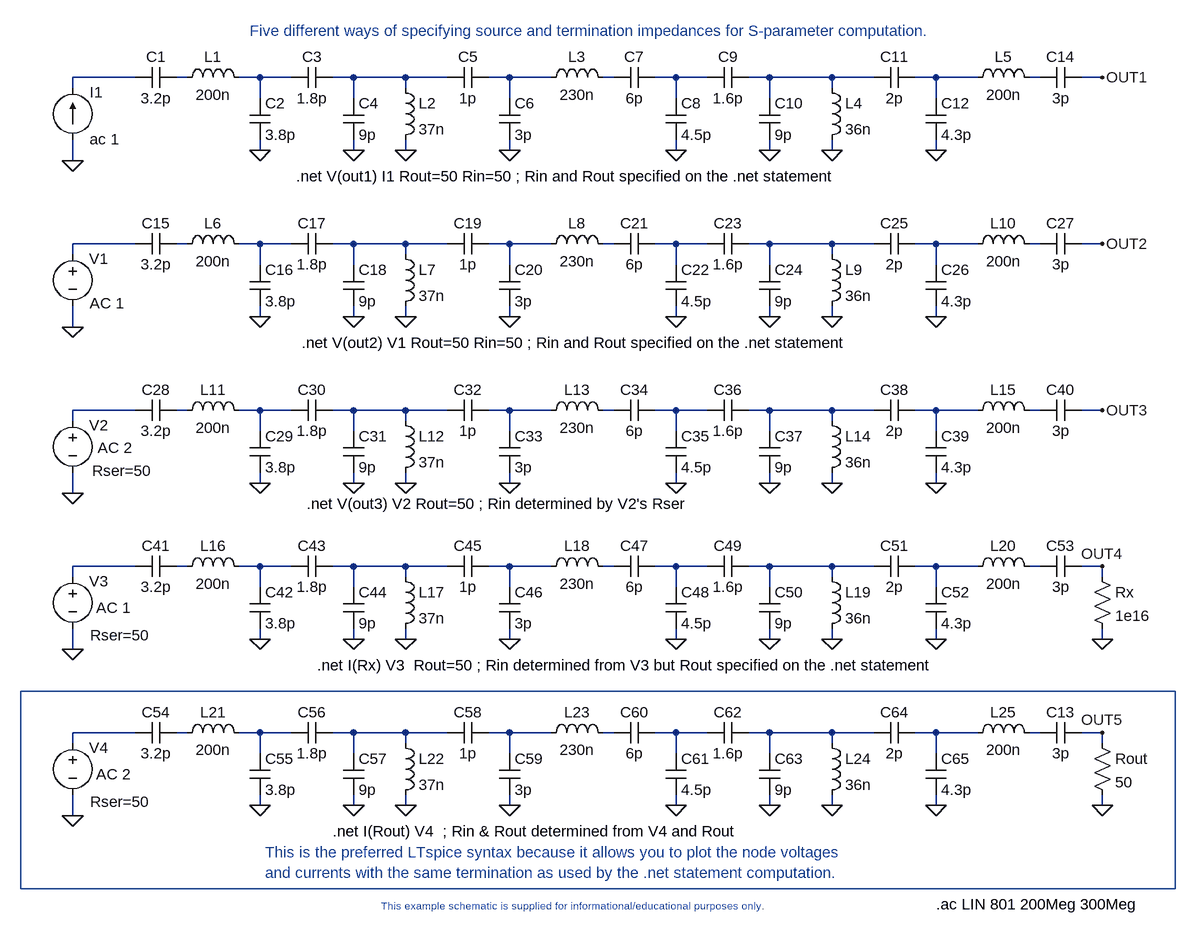
[diagram p0: schematic S-param.asc]
S-param.asc, the LTspice schematic file:
Version 4
SHEET 1 2384 1052
WIRE 128 -608 32 -608
WIRE 208 -608 192 -608
WIRE 320 -608 288 -608
WIRE 368 -608 320 -608
WIRE 464 -608 432 -608
WIRE 544 -608 464 -608
WIRE 608 -608 544 -608
WIRE 704 -608 672 -608
WIRE 768 -608 704 -608
WIRE 864 -608 848 -608
WIRE 960 -608 928 -608
WIRE 1008 -608 960 -608
WIRE 1104 -608 1072 -608
WIRE 1200 -608 1104 -608
WIRE 1264 -608 1200 -608
WIRE 1360 -608 1328 -608
WIRE 1424 -608 1360 -608
WIRE 1520 -608 1504 -608
WIRE 1616 -608 1584 -608
WIRE 32 -592 32 -608
WIRE 544 -592 544 -608
WIRE 1200 -592 1200 -608
WIRE 320 -576 320 -608
WIRE 464 -576 464 -608
WIRE 704 -576 704 -608
WIRE 960 -576 960 -608
WIRE 1104 -576 1104 -608
WIRE 1360 -576 1360 -608
WIRE 320 -496 320 -512
WIRE 464 -496 464 -512
WIRE 544 -496 544 -512
WIRE 704 -496 704 -512
WIRE 960 -496 960 -512
WIRE 1104 -496 1104 -512
WIRE 1200 -496 1200 -512
WIRE 1360 -496 1360 -512
WIRE 32 -480 32 -512
WIRE 128 -352 32 -352
WIRE 208 -352 192 -352
WIRE 320 -352 288 -352
WIRE 368 -352 320 -352
WIRE 464 -352 432 -352
WIRE 544 -352 464 -352
WIRE 608 -352 544 -352
WIRE 704 -352 672 -352
WIRE 768 -352 704 -352
WIRE 864 -352 848 -352
WIRE 960 -352 928 -352
WIRE 1008 -352 960 -352
WIRE 1104 -352 1072 -352
WIRE 1200 -352 1104 -352
WIRE 1264 -352 1200 -352
WIRE 1360 -352 1328 -352
WIRE 1424 -352 1360 -352
WIRE 1520 -352 1504 -352
WIRE 1616 -352 1584 -352
WIRE 32 -336 32 -352
WIRE 544 -336 544 -352
WIRE 1200 -336 1200 -352
WIRE 320 -320 320 -352
WIRE 464 -320 464 -352
WIRE 704 -320 704 -352
WIRE 960 -320 960 -352
WIRE 1104 -320 1104 -352
WIRE 1360 -320 1360 -352
WIRE 320 -240 320 -256
WIRE 464 -240 464 -256
WIRE 544 -240 544 -256
WIRE 704 -240 704 -256
WIRE 960 -240 960 -256
WIRE 1104 -240 1104 -256
WIRE 1200 -240 1200 -256
WIRE 1360 -240 1360 -256
WIRE 32 -224 32 -256
WIRE 128 -96 32 -96
WIRE 208 -96 192 -96
WIRE 320 -96 288 -96
WIRE 368 -96 320 -96
WIRE 464 -96 432 -96
WIRE 544 -96 464 -96
WIRE 608 -96 544 -96
WIRE 704 -96 672 -96
WIRE 768 -96 704 -96
WIRE 864 -96 848 -96
WIRE 960 -96 928 -96
WIRE 1008 -96 960 -96
WIRE 1104 -96 1072 -96
WIRE 1200 -96 1104 -96
WIRE 1264 -96 1200 -96
WIRE 1360 -96 1328 -96
WIRE 1424 -96 1360 -96
WIRE 1520 -96 1504 -96
WIRE 1616 -96 1584 -96
WIRE 32 -80 32 -96
WIRE 544 -80 544 -96
WIRE 1200 -80 1200 -96
WIRE 320 -64 320 -96
WIRE 464 -64 464 -96
WIRE 704 -64 704 -96
WIRE 960 -64 960 -96
WIRE 1104 -64 1104 -96
WIRE 1360 -64 1360 -96
WIRE 320 16 320 0
WIRE 464 16 464 0
WIRE 544 16 544 0
WIRE 704 16 704 0
WIRE 960 16 960 0
WIRE 1104 16 1104 0
WIRE 1200 16 1200 0
WIRE 1360 16 1360 0
WIRE 32 32 32 0
WIRE 128 144 32 144
WIRE 208 144 192 144
WIRE 320 144 288 144
WIRE 368 144 320 144
WIRE 464 144 432 144
WIRE 544 144 464 144
WIRE 608 144 544 144
WIRE 704 144 672 144
WIRE 768 144 704 144
WIRE 864 144 848 144
WIRE 960 144 928 144
WIRE 1008 144 960 144
WIRE 1104 144 1072 144
WIRE 1200 144 1104 144
WIRE 1264 144 1200 144
WIRE 1360 144 1328 144
WIRE 1424 144 1360 144
WIRE 1520 144 1504 144
WIRE 1616 144 1584 144
WIRE 32 160 32 144
WIRE 544 160 544 144
WIRE 1200 160 1200 144
WIRE 1616 160 1616 144
WIRE 320 176 320 144
WIRE 464 176 464 144
WIRE 704 176 704 144
WIRE 960 176 960 144
WIRE 1104 176 1104 144
WIRE 1360 176 1360 144
WIRE 320 256 320 240
WIRE 464 256 464 240
WIRE 544 256 544 240
WIRE 704 256 704 240
WIRE 960 256 960 240
WIRE 1104 256 1104 240
WIRE 1200 256 1200 240
WIRE 1360 256 1360 240
WIRE 1616 256 1616 240
WIRE 32 272 32 240
WIRE 128 400 32 400
WIRE 208 400 192 400
WIRE 320 400 288 400
WIRE 368 400 320 400
WIRE 464 400 432 400
WIRE 544 400 464 400
WIRE 608 400 544 400
WIRE 704 400 672 400
WIRE 768 400 704 400
WIRE 864 400 848 400
WIRE 960 400 928 400
WIRE 1008 400 960 400
WIRE 1104 400 1072 400
WIRE 1200 400 1104 400
WIRE 1264 400 1200 400
WIRE 1360 400 1328 400
WIRE 1424 400 1360 400
WIRE 1520 400 1504 400
WIRE 1616 400 1584 400
WIRE 32 416 32 400
WIRE 544 416 544 400
WIRE 1200 416 1200 400
WIRE 1616 416 1616 400
WIRE 320 432 320 400
WIRE 464 432 464 400
WIRE 704 432 704 400
WIRE 960 432 960 400
WIRE 1104 432 1104 400
WIRE 1360 432 1360 400
WIRE 320 512 320 496
WIRE 464 512 464 496
WIRE 544 512 544 496
WIRE 704 512 704 496
WIRE 960 512 960 496
WIRE 1104 512 1104 496
WIRE 1200 512 1200 496
WIRE 1360 512 1360 496
WIRE 1616 512 1616 496
WIRE 32 528 32 496
FLAG 32 528 0
FLAG 1616 512 0
FLAG 32 32 0
FLAG 1616 -96 OUT3
FLAG 32 -224 0
FLAG 1616 -352 OUT2
FLAG 32 -480 0
FLAG 1616 -608 OUT1
FLAG 32 272 0
FLAG 1616 256 0
FLAG 1616 144 OUT4
FLAG 1616 400 OUT5
FLAG 320 -496 0
FLAG 464 -496 0
FLAG 544 -496 0
FLAG 704 -496 0
FLAG 960 -496 0
FLAG 1104 -496 0
FLAG 1200 -496 0
FLAG 1360 -496 0
FLAG 320 -240 0
FLAG 464 -240 0
FLAG 544 -240 0
FLAG 704 -240 0
FLAG 960 -240 0
FLAG 1104 -240 0
FLAG 1200 -240 0
FLAG 1360 -240 0
FLAG 320 16 0
FLAG 464 16 0
FLAG 544 16 0
FLAG 704 16 0
FLAG 960 16 0
FLAG 1104 16 0
FLAG 1200 16 0
FLAG 1360 16 0
FLAG 320 256 0
FLAG 464 256 0
FLAG 544 256 0
FLAG 704 256 0
FLAG 960 256 0
FLAG 1104 256 0
FLAG 1200 256 0
FLAG 1360 256 0
FLAG 320 512 0
FLAG 464 512 0
FLAG 544 512 0
FLAG 704 512 0
FLAG 960 512 0
FLAG 1104 512 0
FLAG 1200 512 0
FLAG 1360 512 0
SYMBOL res 1600 400 R0
SYMATTR InstName Rout
SYMATTR Value 50
SYMBOL voltage 32 400 R0
WINDOW 0 25 23 Left 2
WINDOW 3 25 93 Left 2
WINDOW 123 36 64 Left 2
WINDOW 39 27 106 Left 2
SYMATTR InstName V4
SYMATTR Value ""
SYMATTR Value2 AC 2
SYMATTR SpiceLine Rser=50
SYMBOL voltage 32 -96 R0
WINDOW 0 25 23 Left 2
WINDOW 3 25 93 Left 2
WINDOW 123 38 58 Left 2
WINDOW 39 30 93 Left 2
SYMATTR InstName V2
SYMATTR Value ""
SYMATTR Value2 AC 2
SYMATTR SpiceLine Rser=50
SYMBOL voltage 32 -352 R0
WINDOW 0 25 23 Left 2
WINDOW 3 25 93 Left 2
WINDOW 123 26 91 Left 2
SYMATTR InstName V1
SYMATTR Value ""
SYMATTR Value2 AC 1
SYMBOL current 32 -512 M180
WINDOW 0 26 73 Left 2
WINDOW 3 26 1 Left 2
SYMATTR InstName I1
SYMATTR Value ac 1
SYMBOL res 1600 144 R0
SYMATTR InstName Rx
SYMATTR Value 1e16
SYMBOL voltage 32 144 R0
WINDOW 0 25 23 Left 2
WINDOW 3 25 93 Left 2
WINDOW 123 36 64 Left 2
WINDOW 39 27 106 Left 2
SYMATTR InstName V3
SYMATTR Value ""
SYMATTR Value2 AC 1
SYMATTR SpiceLine Rser=50
SYMBOL cap 128 -624 M90
WINDOW 0 0 32 VBottom 2
WINDOW 3 32 32 VTop 2
SYMATTR InstName C1
SYMATTR Value 3.2p
SYMBOL ind 192 -592 R270
WINDOW 0 32 56 VTop 2
WINDOW 3 5 56 VBottom 2
SYMATTR InstName L1
SYMATTR Value 200n
SYMBOL cap 304 -576 R0
SYMATTR InstName C2
SYMATTR Value 3.8p
SYMBOL cap 368 -624 M90
WINDOW 0 0 32 VBottom 2
WINDOW 3 32 32 VTop 2
SYMATTR InstName C3
SYMATTR Value 1.8p
SYMBOL cap 448 -576 R0
SYMATTR InstName C4
SYMATTR Value 9p
SYMBOL ind 528 -608 R0
SYMATTR InstName L2
SYMATTR Value 37n
SYMBOL cap 608 -624 M90
WINDOW 0 0 32 VBottom 2
WINDOW 3 32 32 VTop 2
SYMATTR InstName C5
SYMATTR Value 1p
SYMBOL cap 688 -576 R0
SYMATTR InstName C6
SYMATTR Value 3p
SYMBOL ind 752 -592 R270
WINDOW 0 32 56 VTop 2
WINDOW 3 5 56 VBottom 2
SYMATTR InstName L3
SYMATTR Value 230n
SYMBOL cap 864 -624 M90
WINDOW 0 0 32 VBottom 2
WINDOW 3 32 32 VTop 2
SYMATTR InstName C7
SYMATTR Value 6p
SYMBOL cap 944 -576 R0
SYMATTR InstName C8
SYMATTR Value 4.5p
SYMBOL cap 1008 -624 M90
WINDOW 0 0 32 VBottom 2
WINDOW 3 32 32 VTop 2
SYMATTR InstName C9
SYMATTR Value 1.6p
SYMBOL cap 1088 -576 R0
SYMATTR InstName C10
SYMATTR Value 9p
SYMBOL ind 1184 -608 R0
SYMATTR InstName L4
SYMATTR Value 36n
SYMBOL cap 1264 -624 M90
WINDOW 0 0 32 VBottom 2
WINDOW 3 32 32 VTop 2
SYMATTR InstName C11
SYMATTR Value 2p
SYMBOL cap 1344 -576 R0
SYMATTR InstName C12
SYMATTR Value 4.3p
SYMBOL ind 1408 -592 R270
WINDOW 0 32 56 VTop 2
WINDOW 3 5 56 VBottom 2
SYMATTR InstName L5
SYMATTR Value 200n
SYMBOL cap 1520 -624 M90
WINDOW 0 0 32 VBottom 2
WINDOW 3 32 32 VTop 2
SYMATTR InstName C14
SYMATTR Value 3p
SYMBOL cap 128 -368 M90
WINDOW 0 0 32 VBottom 2
WINDOW 3 32 32 VTop 2
SYMATTR InstName C15
SYMATTR Value 3.2p
SYMBOL ind 192 -336 R270
WINDOW 0 32 56 VTop 2
WINDOW 3 5 56 VBottom 2
SYMATTR InstName L6
SYMATTR Value 200n
SYMBOL cap 304 -320 R0
SYMATTR InstName C16
SYMATTR Value 3.8p
SYMBOL cap 368 -368 M90
WINDOW 0 0 32 VBottom 2
WINDOW 3 32 32 VTop 2
SYMATTR InstName C17
SYMATTR Value 1.8p
SYMBOL cap 448 -320 R0
SYMATTR InstName C18
SYMATTR Value 9p
SYMBOL ind 528 -352 R0
SYMATTR InstName L7
SYMATTR Value 37n
SYMBOL cap 608 -368 M90
WINDOW 0 0 32 VBottom 2
WINDOW 3 32 32 VTop 2
SYMATTR InstName C19
SYMATTR Value 1p
SYMBOL cap 688 -320 R0
SYMATTR InstName C20
SYMATTR Value 3p
SYMBOL ind 752 -336 R270
WINDOW 0 32 56 VTop 2
WINDOW 3 5 56 VBottom 2
SYMATTR InstName L8
SYMATTR Value 230n
SYMBOL cap 864 -368 M90
WINDOW 0 0 32 VBottom 2
WINDOW 3 32 32 VTop 2
SYMATTR InstName C21
SYMATTR Value 6p
SYMBOL cap 944 -320 R0
SYMATTR InstName C22
SYMATTR Value 4.5p
SYMBOL cap 1008 -368 M90
WINDOW 0 0 32 VBottom 2
WINDOW 3 32 32 VTop 2
SYMATTR InstName C23
SYMATTR Value 1.6p
SYMBOL cap 1088 -320 R0
SYMATTR InstName C24
SYMATTR Value 9p
SYMBOL ind 1184 -352 R0
SYMATTR InstName L9
SYMATTR Value 36n
SYMBOL cap 1264 -368 M90
WINDOW 0 0 32 VBottom 2
WINDOW 3 32 32 VTop 2
SYMATTR InstName C25
SYMATTR Value 2p
SYMBOL cap 1344 -320 R0
SYMATTR InstName C26
SYMATTR Value 4.3p
SYMBOL ind 1408 -336 R270
WINDOW 0 32 56 VTop 2
WINDOW 3 5 56 VBottom 2
SYMATTR InstName L10
SYMATTR Value 200n
SYMBOL cap 1520 -368 M90
WINDOW 0 0 32 VBottom 2
WINDOW 3 32 32 VTop 2
SYMATTR InstName C27
SYMATTR Value 3p
SYMBOL cap 128 -112 M90
WINDOW 0 0 32 VBottom 2
WINDOW 3 32 32 VTop 2
SYMATTR InstName C28
SYMATTR Value 3.2p
SYMBOL ind 192 -80 R270
WINDOW 0 32 56 VTop 2
WINDOW 3 5 56 VBottom 2
SYMATTR InstName L11
SYMATTR Value 200n
SYMBOL cap 304 -64 R0
SYMATTR InstName C29
SYMATTR Value 3.8p
SYMBOL cap 368 -112 M90
WINDOW 0 0 32 VBottom 2
WINDOW 3 32 32 VTop 2
SYMATTR InstName C30
SYMATTR Value 1.8p
SYMBOL cap 448 -64 R0
SYMATTR InstName C31
SYMATTR Value 9p
SYMBOL ind 528 -96 R0
SYMATTR InstName L12
SYMATTR Value 37n
SYMBOL cap 608 -112 M90
WINDOW 0 0 32 VBottom 2
WINDOW 3 32 32 VTop 2
SYMATTR InstName C32
SYMATTR Value 1p
SYMBOL cap 688 -64 R0
SYMATTR InstName C33
SYMATTR Value 3p
SYMBOL ind 752 -80 R270
WINDOW 0 32 56 VTop 2
WINDOW 3 5 56 VBottom 2
SYMATTR InstName L13
SYMATTR Value 230n
SYMBOL cap 864 -112 M90
WINDOW 0 0 32 VBottom 2
WINDOW 3 32 32 VTop 2
SYMATTR InstName C34
SYMATTR Value 6p
SYMBOL cap 944 -64 R0
SYMATTR InstName C35
SYMATTR Value 4.5p
SYMBOL cap 1008 -112 M90
WINDOW 0 0 32 VBottom 2
WINDOW 3 32 32 VTop 2
SYMATTR InstName C36
SYMATTR Value 1.6p
SYMBOL cap 1088 -64 R0
SYMATTR InstName C37
SYMATTR Value 9p
SYMBOL ind 1184 -96 R0
SYMATTR InstName L14
SYMATTR Value 36n
SYMBOL cap 1264 -112 M90
WINDOW 0 0 32 VBottom 2
WINDOW 3 32 32 VTop 2
SYMATTR InstName C38
SYMATTR Value 2p
SYMBOL cap 1344 -64 R0
SYMATTR InstName C39
SYMATTR Value 4.3p
SYMBOL ind 1408 -80 R270
WINDOW 0 32 56 VTop 2
WINDOW 3 5 56 VBottom 2
SYMATTR InstName L15
SYMATTR Value 200n
SYMBOL cap 1520 -112 M90
WINDOW 0 0 32 VBottom 2
WINDOW 3 32 32 VTop 2
SYMATTR InstName C40
SYMATTR Value 3p
SYMBOL cap 128 128 M90
WINDOW 0 0 32 VBottom 2
WINDOW 3 32 32 VTop 2
SYMATTR InstName C41
SYMATTR Value 3.2p
SYMBOL ind 192 160 R270
WINDOW 0 32 56 VTop 2
WINDOW 3 5 56 VBottom 2
SYMATTR InstName L16
SYMATTR Value 200n
SYMBOL cap 304 176 R0
SYMATTR InstName C42
SYMATTR Value 3.8p
SYMBOL cap 368 128 M90
WINDOW 0 0 32 VBottom 2
WINDOW 3 32 32 VTop 2
SYMATTR InstName C43
SYMATTR Value 1.8p
SYMBOL cap 448 176 R0
SYMATTR InstName C44
SYMATTR Value 9p
SYMBOL ind 528 144 R0
SYMATTR InstName L17
SYMATTR Value 37n
SYMBOL cap 608 128 M90
WINDOW 0 0 32 VBottom 2
WINDOW 3 32 32 VTop 2
SYMATTR InstName C45
SYMATTR Value 1p
SYMBOL cap 688 176 R0
SYMATTR InstName C46
SYMATTR Value 3p
SYMBOL ind 752 160 R270
WINDOW 0 32 56 VTop 2
WINDOW 3 5 56 VBottom 2
SYMATTR InstName L18
SYMATTR Value 230n
SYMBOL cap 864 128 M90
WINDOW 0 0 32 VBottom 2
WINDOW 3 32 32 VTop 2
SYMATTR InstName C47
SYMATTR Value 6p
SYMBOL cap 944 176 R0
SYMATTR InstName C48
SYMATTR Value 4.5p
SYMBOL cap 1008 128 M90
WINDOW 0 0 32 VBottom 2
WINDOW 3 32 32 VTop 2
SYMATTR InstName C49
SYMATTR Value 1.6p
SYMBOL cap 1088 176 R0
SYMATTR InstName C50
SYMATTR Value 9p
SYMBOL ind 1184 144 R0
SYMATTR InstName L19
SYMATTR Value 36n
SYMBOL cap 1264 128 M90
WINDOW 0 0 32 VBottom 2
WINDOW 3 32 32 VTop 2
SYMATTR InstName C51
SYMATTR Value 2p
SYMBOL cap 1344 176 R0
SYMATTR InstName C52
SYMATTR Value 4.3p
SYMBOL ind 1408 160 R270
WINDOW 0 32 56 VTop 2
WINDOW 3 5 56 VBottom 2
SYMATTR InstName L20
SYMATTR Value 200n
SYMBOL cap 1520 128 M90
WINDOW 0 0 32 VBottom 2
WINDOW 3 32 32 VTop 2
SYMATTR InstName C53
SYMATTR Value 3p
SYMBOL cap 128 384 M90
WINDOW 0 0 32 VBottom 2
WINDOW 3 32 32 VTop 2
SYMATTR InstName C54
SYMATTR Value 3.2p
SYMBOL ind 192 416 R270
WINDOW 0 32 56 VTop 2
WINDOW 3 5 56 VBottom 2
SYMATTR InstName L21
SYMATTR Value 200n
SYMBOL cap 304 432 R0
SYMATTR InstName C55
SYMATTR Value 3.8p
SYMBOL cap 368 384 M90
WINDOW 0 0 32 VBottom 2
WINDOW 3 32 32 VTop 2
SYMATTR InstName C56
SYMATTR Value 1.8p
SYMBOL cap 448 432 R0
SYMATTR InstName C57
SYMATTR Value 9p
SYMBOL ind 528 400 R0
SYMATTR InstName L22
SYMATTR Value 37n
SYMBOL cap 608 384 M90
WINDOW 0 0 32 VBottom 2
WINDOW 3 32 32 VTop 2
SYMATTR InstName C58
SYMATTR Value 1p
SYMBOL cap 688 432 R0
SYMATTR InstName C59
SYMATTR Value 3p
SYMBOL ind 752 416 R270
WINDOW 0 32 56 VTop 2
WINDOW 3 5 56 VBottom 2
SYMATTR InstName L23
SYMATTR Value 230n
SYMBOL cap 864 384 M90
WINDOW 0 0 32 VBottom 2
WINDOW 3 32 32 VTop 2
SYMATTR InstName C60
SYMATTR Value 6p
SYMBOL cap 944 432 R0
SYMATTR InstName C61
SYMATTR Value 4.5p
SYMBOL cap 1008 384 M90
WINDOW 0 0 32 VBottom 2
WINDOW 3 32 32 VTop 2
SYMATTR InstName C62
SYMATTR Value 1.6p
SYMBOL cap 1088 432 R0
SYMATTR InstName C63
SYMATTR Value 9p
SYMBOL ind 1184 400 R0
SYMATTR InstName L24
SYMATTR Value 36n
SYMBOL cap 1264 384 M90
WINDOW 0 0 32 VBottom 2
WINDOW 3 32 32 VTop 2
SYMATTR InstName C64
SYMATTR Value 2p
SYMBOL cap 1344 432 R0
SYMATTR InstName C65
SYMATTR Value 4.3p
SYMBOL ind 1408 416 R270
WINDOW 0 32 56 VTop 2
WINDOW 3 5 56 VBottom 2
SYMATTR InstName L25
SYMATTR Value 200n
SYMBOL cap 1520 384 M90
WINDOW 0 0 32 VBottom 2
WINDOW 3 32 32 VTop 2
SYMATTR InstName C13
SYMATTR Value 3p
TEXT 1360 664 Left 2 !.ac LIN 801 200Meg 300Meg
TEXT 432 552 Left 2 !.net I(Rout) V4  ; Rin & Rout determined from V4 and Rout
TEXT 392 48 Left 2 !.net V(out3) V2 Rout=50 ; Rin determined by V2's Rser
TEXT 384 -200 Left 2 !.net V(out2) V1 Rout=50 Rin=50 ; Rin and Rout specified on the .net statement
TEXT 376 -456 Left 2 !.net V(out1) I1 Rout=50 Rin=50 ; Rin and Rout specified on the .net statement
TEXT 408 296 Left 2 !.net I(Rx) V3  Rout=50 ; Rin determined from V3 but Rout specified on the .net statement
TEXT 328 584 Left 2 ;This is the preferred LTspice syntax because it allows you to plot the node voltages\nand currents with the same termination as used by the .net statement computation.
TEXT 832 -664 Bottom 2 ;Five different ways of specifying source and termination impedances for S-parameter computation.
TEXT 792 656 Top 1 ;This example schematic is supplied for informational/educational purposes only.
RECTANGLE Normal 1728 640 -48 336

The netlist it stands for:
* S-param.asc
Rout OUT5 0 50
V4 N041 0 AC 2 Rser=50
V2 N021 0 AC 2 Rser=50
V1 N011 0 AC 1
I1 0 N001 ac 1
Rx OUT4 0 1e16
V3 N031 0 AC 1 Rser=50
C1 N001 N002 3.2p
L1 N002 N003 200n
C2 N003 0 3.8p
C3 N003 N004 1.8p
C4 N004 0 9p
L2 N004 0 37n
C5 N004 N005 1p
C6 N005 0 3p
L3 N005 N006 230n
C7 N006 N007 6p
C8 N007 0 4.5p
C9 N007 N008 1.6p
C10 N008 0 9p
L4 N008 0 36n
C11 N008 N009 2p
C12 N009 0 4.3p
L5 N009 N010 200n
C14 N010 OUT1 3p
C15 N011 N012 3.2p
L6 N012 N013 200n
C16 N013 0 3.8p
C17 N013 N014 1.8p
C18 N014 0 9p
L7 N014 0 37n
C19 N014 N015 1p
C20 N015 0 3p
L8 N015 N016 230n
C21 N016 N017 6p
C22 N017 0 4.5p
C23 N017 N018 1.6p
C24 N018 0 9p
L9 N018 0 36n
C25 N018 N019 2p
C26 N019 0 4.3p
L10 N019 N020 200n
C27 N020 OUT2 3p
C28 N021 N022 3.2p
L11 N022 N023 200n
C29 N023 0 3.8p
C30 N023 N024 1.8p
C31 N024 0 9p
L12 N024 0 37n
C32 N024 N025 1p
C33 N025 0 3p
L13 N025 N026 230n
C34 N026 N027 6p
C35 N027 0 4.5p
C36 N027 N028 1.6p
C37 N028 0 9p
L14 N028 0 36n
C38 N028 N029 2p
C39 N029 0 4.3p
L15 N029 N030 200n
C40 N030 OUT3 3p
C41 N031 N032 3.2p
L16 N032 N033 200n
C42 N033 0 3.8p
C43 N033 N034 1.8p
C44 N034 0 9p
L17 N034 0 37n
C45 N034 N035 1p
C46 N035 0 3p
L18 N035 N036 230n
C47 N036 N037 6p
C48 N037 0 4.5p
C49 N037 N038 1.6p
C50 N038 0 9p
L19 N038 0 36n
C51 N038 N039 2p
C52 N039 0 4.3p
L20 N039 N040 200n
C53 N040 OUT4 3p
C54 N041 N042 3.2p
L21 N042 N043 200n
C55 N043 0 3.8p
C56 N043 N044 1.8p
C57 N044 0 9p
L22 N044 0 37n
C58 N044 N045 1p
C59 N045 0 3p
L23 N045 N046 230n
C60 N046 N047 6p
C61 N047 0 4.5p
C62 N047 N048 1.6p
C63 N048 0 9p
L24 N048 0 36n
C64 N048 N049 2p
C65 N049 0 4.3p
L25 N049 N050 200n
C13 N050 OUT5 3p
.ac LIN 801 200Meg 300Meg
.net I(Rout) V4  ; Rin & Rout determined from V4 and Rout
.net V(out3) V2 Rout=50 ; Rin determined by V2's Rser
.net V(out2) V1 Rout=50 Rin=50 ; Rin and Rout specified on the .net statement
.net V(out1) I1 Rout=50 Rin=50 ; Rin and Rout specified on the .net statement
.net I(Rx) V3  Rout=50 ; Rin determined from V3 but Rout specified on the .net statement
* This is the preferred LTspice syntax because it allows you to plot the node voltages
* and currents with the same termination as used by the .net statement computation.
* Five different ways of specifying source and termination impedances for S-parameter computation.
* This example schematic is supplied for informational/educational purposes only.
.backanno
.end